# Altium schematic sheet HMI.SchDoc
size A2
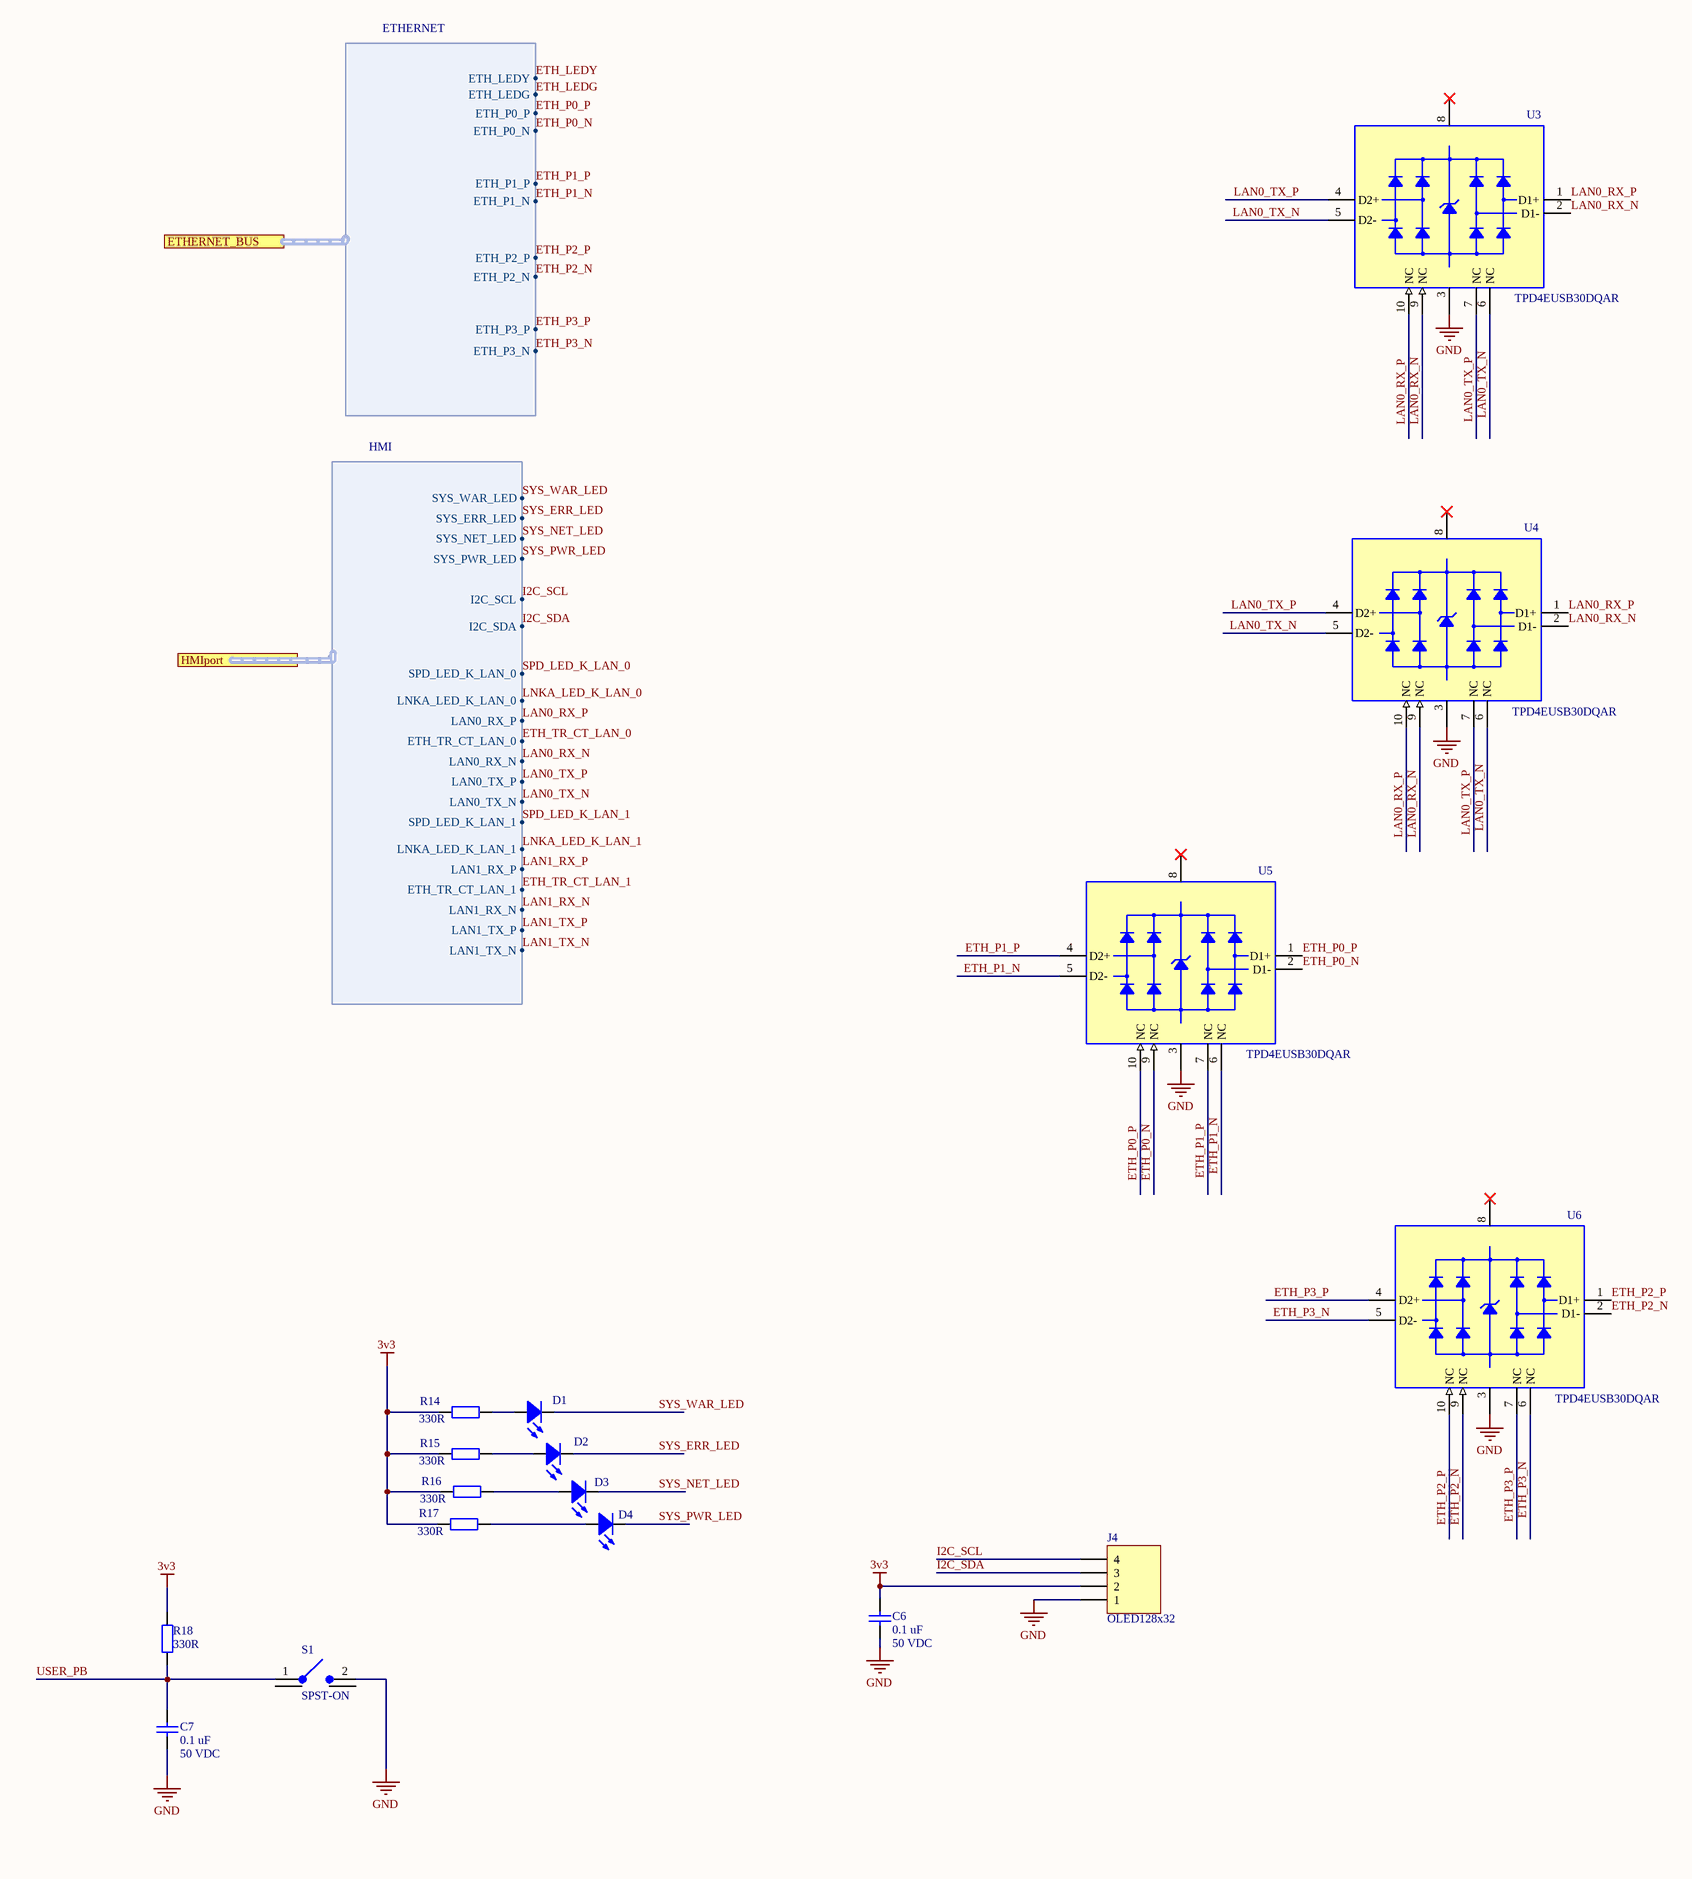
[diagram p0: HMI.SchDoc, left]
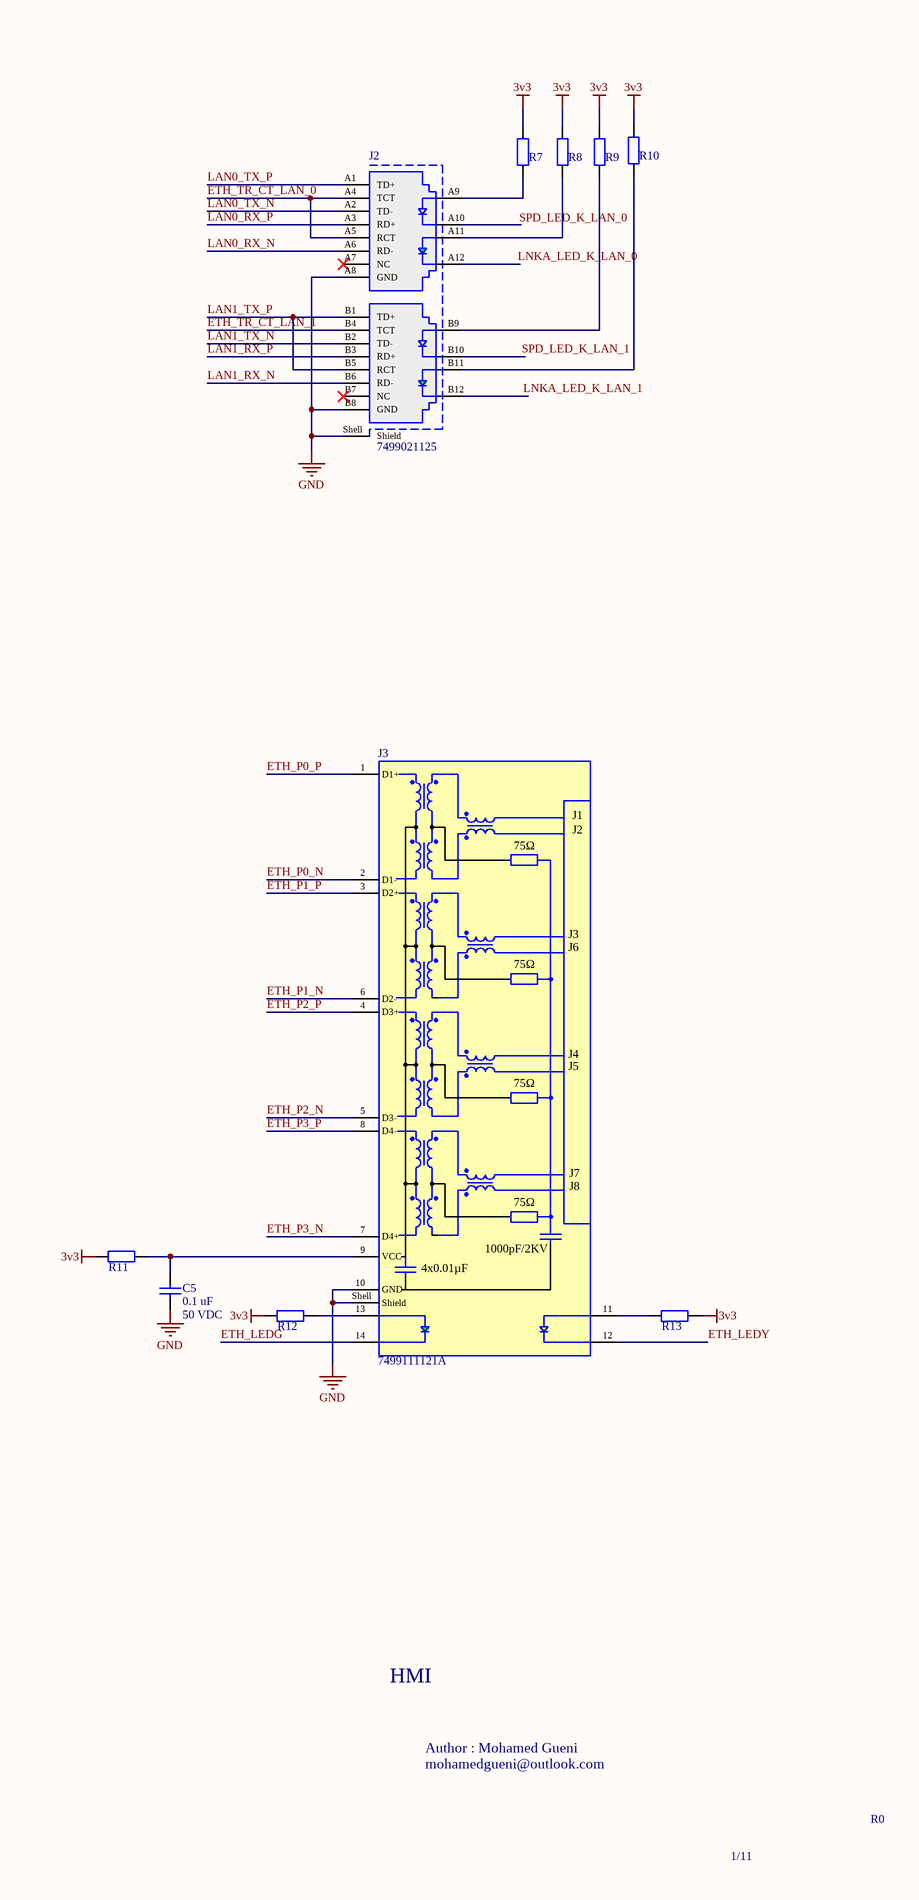
[diagram p1: HMI.SchDoc, right]

## Parts
C5  Value 1: 0.1 uF  Value 2: 50 VDC  [CAPC1608N]  (hidden comment: Capacitor)
C6  Value 1: 0.1 uF  Value 2: 50 VDC  [CAPC1608N]  (hidden comment: Capacitor)
C7  Value 1: 0.1 uF  Value 2: 50 VDC  [CAPC1608N]  (hidden comment: Capacitor)
D1  150060BS75000  [LED0603]  (value not drawn)
D2  150060RS75000  [LED0603]  (value not drawn)
D3  150060GS75000  [LED0603]  (value not drawn)
D4  150060GS75000  [LED0603]  (value not drawn)
J2  7499021125  [WE-RJ45-7499021125]
J3  7499111121A  [WE-RJ45-7499111121A]
J4  OLED128x32  [OLED128x32]
R7  Resistor  [RESC1608N]  (value not drawn)
R8  Resistor  [RESC1608N]  (value not drawn)
R9  Resistor  [RESC1608N]  (value not drawn)
R10  Resistor  [RESC1608N]  (value not drawn)
R11  Resistor  [RESC1608N]  (value not drawn)
R12  Resistor  [RESC1608N]  (value not drawn)
R13  Resistor  [RESC1608N]  (value not drawn)
R14  Value 1: 330R  [RESC1608N]  (hidden comment: Resistor)
R15  Value 1: 330R  [RESC1608N]  (hidden comment: Resistor)
R16  Value 1: 330R  [RESC1608N]  (hidden comment: Resistor)
R17  Value 1: 330R  [RESC1608N]  (hidden comment: Resistor)
R18  Value 1: 330R  [RESC1608N]  (hidden comment: Resistor)
S1  SPST-ON  [118250272]
U3  TPD4EUSB30DQAR  [USON-10]
U4  TPD4EUSB30DQAR  [USON-10]
U5  TPD4EUSB30DQAR  [USON-10]
U6  TPD4EUSB30DQAR  [USON-10]

## Ports
ETHERNET_BUS (harness ETHERNET), HMIport (harness ETHERNET)

## Harnesses
ETHERNET: ETH_LEDY, ETH_P0_P, ETH_P0_N, ETH_P1_P, ETH_P1_N, ETH_P2_P, ETH_P2_N, ETH_P3_P, ETH_P3_N, ETH_LEDG
HMI: SYS_WAR_LED, SYS_NET_LED, SYS_PWR_LED, I2C_SCL, I2C_SDA, SPD_LED_K_LAN_0, SYS_ERR_LED, LNKA_LED_K_LAN_0, LAN0_RX_P, ETH_TR_CT_LAN_0, LAN0_RX_N, LAN0_TX_P, LAN0_TX_N, SPD_LED_K_LAN_1, LNKA_LED_K_LAN_1, LAN1_RX_P, ETH_TR_CT_LAN_1, LAN1_RX_N, LAN1_TX_P, LAN1_TX_N

## Nets
3v3: C6.2 J4.2 R7.2 R8.2 R9.2 R10.2 R11.2 R12.2 R13.2 R14.1 R15.1 R16.1 R17.1 R18.2
GND: C5.1 C6.1 C7.1 J2.A8(GND) J2.B8(GND) J2.Shell(Shield) J3.10(GND) J3.Shell(Shield) J4.1 S1.2(NO) U3.3(GND) U4.3(GND) U5.3(GND) U6.3(GND)
ETH_LEDG: J3.14 ; port ETHERNET_BUS.ETH_LEDG
ETH_LEDY: J3.12 ; port ETHERNET_BUS.ETH_LEDY
ETH_P0_N: J3.2(D1-) U5.2(D1-) U5.9(NC) ; port ETHERNET_BUS.ETH_P0_N
ETH_P0_P: J3.1(D1+) U5.1(D1+) U5.10(NC) ; port ETHERNET_BUS.ETH_P0_P
ETH_P1_N: J3.6(D2-) U5.5(D2-) U5.6(NC) ; port ETHERNET_BUS.ETH_P1_N
ETH_P1_P: J3.3(D2+) U5.4(D2+) U5.7(NC) ; port ETHERNET_BUS.ETH_P1_P
ETH_P2_N: J3.5(D3-) U6.2(D1-) U6.9(NC) ; port ETHERNET_BUS.ETH_P2_N
ETH_P2_P: J3.4(D3+) U6.1(D1+) U6.10(NC) ; port ETHERNET_BUS.ETH_P2_P
ETH_P3_N: J3.7(D4+) U6.5(D2-) U6.6(NC) ; port ETHERNET_BUS.ETH_P3_N
ETH_P3_P: J3.8(D4-) U6.4(D2+) U6.7(NC) ; port ETHERNET_BUS.ETH_P3_P
ETH_TR_CT_LAN_0: J2.A4(TCT) J2.A5(RCT) ; harness HMI.ETH_TR_CT_LAN_0
ETH_TR_CT_LAN_1: J2.B4(TCT) ; harness HMI.ETH_TR_CT_LAN_1
I2C_SCL: J4.4 ; harness HMI.I2C_SCL
I2C_SDA: J4.3 ; harness HMI.I2C_SDA
LAN0_RX_N: J2.A6(RD-) U3.2(D1-) U3.9(NC) U4.2(D1-) U4.9(NC) ; harness HMI.LAN0_RX_N
LAN0_RX_P: J2.A3(RD+) U3.1(D1+) U3.10(NC) U4.1(D1+) U4.10(NC) ; harness HMI.LAN0_RX_P
LAN0_TX_N: J2.A2(TD-) U3.5(D2-) U3.6(NC) U4.5(D2-) U4.6(NC) ; harness HMI.LAN0_TX_N
LAN0_TX_P: J2.A1(TD+) U3.4(D2+) U3.7(NC) U4.4(D2+) U4.7(NC) ; harness HMI.LAN0_TX_P
LAN1_RX_N: J2.B6(RD-) ; harness HMI.LAN1_RX_N
LAN1_RX_P: J2.B3(RD+) ; harness HMI.LAN1_RX_P
LAN1_TX_N: J2.B2(TD-) ; harness HMI.LAN1_TX_N
LAN1_TX_P: J2.B1(TD+) J2.B5(RCT) ; harness HMI.LAN1_TX_P
LNKA_LED_K_LAN_0: J2.A12 ; harness HMI.LNKA_LED_K_LAN_0
LNKA_LED_K_LAN_1: J2.B12 ; harness HMI.LNKA_LED_K_LAN_1
SPD_LED_K_LAN_0: harness HMI.SPD_LED_K_LAN_0
SPD_LED_K_LAN_1: J2.B10 ; harness HMI.SPD_LED_K_LAN_1
SYS_ERR_LED: D2.1(K) ; harness HMI.SYS_ERR_LED
SYS_NET_LED: D3.1(K) ; harness HMI.SYS_NET_LED
SYS_PWR_LED: D4.1(K) ; harness HMI.SYS_PWR_LED
SYS_WAR_LED: D1.1(K) ; harness HMI.SYS_WAR_LED
USER_PB: C7.2 R18.1 S1.1(COM)
NetC5_2: C5.2 J3.9(VCC) R11.1
NetD1_2: D1.2(A) R14.2
NetD2_2: D2.2(A) R15.2
NetD3_2: D3.2(A) R16.2
NetD4_2: D4.2(A) R17.2
NetJ2_A9: J2.A9 R7.1
NetJ2_A11: J2.A11 R8.1
NetJ2_B9: J2.B9 R9.1
NetJ2_B11: J2.B11 R10.1
NetJ3_11: J3.11 R13.1
NetJ3_13: J3.13 R12.1

Not connected (* = marked no-connect by the designer): J2 A7(NC)* A10 B7(NC)*; S1 MH1 MH2; U3 8(GND)*; U4 8(GND)*; U5 8(GND)*; U6 8(GND)*

## Notes on the sheet
- HMI
- Author : Mohamed Gueni
- mohamedgueni@outlook.com
- 1/11
- R0
- Labels drawn without touching a wire or pin: SPD_LED_K_LAN_0
- (in symbol CON-000000002) J1; J2; 75Ω; J6; J4; J5; J7; J8; 1000pF/2KV; 4x0.01µF

## Library data of the parts
C5-C7 = CAP-000000003: MAN: KEMET; MANREF: C0603C104M5RAC; DES: Multilayer Ceramic Capacitors MLCC - SMD/SMT 50V 0.1uF 0603 X7R 20%; TOL: 20 %; FTP: 0603; SUP: Mouser; SUPREF: 80-C0603C104M5RAC; NOTE: _; Part Number: CAP-000000003
D1 = LED-000000003: MAN: Wurth Elektronik; DES: Standard LEDs - SMD WL-SMCW SMDMono TpVw Waterclr 0603 Blue; Value 1: 0.02A; Value 2: 3.2 V; TOL: _; FTP: 0603; SUP: Mouser; SUPREF: 710-150060BS75000; Part Number: LED-000000003; MANREF: 150060BS75000; NOTE: _
D2 = LED-000000001: MAN: Wurth Elektronik; DES: Standard LEDs - SMD WL-SMCW SMDMono TpVw Waterclr 0603 Red; Value 1: 0.02A; Value 2: 2 V; TOL: _; FTP: 0603; SUP: Mouser; SUPREF: 710-150060RS75000; Part Number: LED-000000001; MANREF: 150060RS75000; NOTE: _
D3 D4 = LED-000000002: MAN: Wurth Elektronik; DES: Standard LEDs - SMD WL-SMCW SMDMono TpVw Waterclr 0603 Green; Value 1: 0.02A; Value 2: 3.2 V; TOL: _; FTP: 0603; SUP: Mouser; SUPREF: 710-150060GS75000; Part Number: LED-000000002; MANREF: 150060GS75000; NOTE: _
J2 = CON-000000008: MAN: Wurth Elektronik; DES: Modular Connectors / Ethernet Connectors WE-RJ45 Intgtd XFMR 1x2 THT Tab Down EMI; Value 1: _; Value 2: 10/100BaseT; FTP: THT; SUP: Mouser; SUPREF: 710-7499021125; Part Number: CON-000000008; MANREF: 7499021125; TOL: _; NOTE: _
J3 = CON-000000002: MAN: Wurth Elektronik; DES: Modular Connectors / Ethernet Connectors WE-RJ45 Intgtd XFMR 1x1 THT Tab Down EMI; Value 1: _; Value 2: 10/100/1000BaseT; FTP: THT; SUP: Mouser; SUPREF: 710-7499111121A; Part Number: CON-000000002; MANREF: 7499111121A; TOL: _; NOTE: _
J4 = CON-000000009: Part Number: CON-000000009
R7-R13 = RES-000000008: MAN: KOA Speer; Value 1: 330R; Part Number: RES-000000008
R14-R18 = RES-000000008: MAN: KOA Speer; Part Number: RES-000000008
S1 = S-000000001: MAN: TE Connectivity / P&B; MANREF: 1-1825027-2; DES: Tactile Switches R/A TACT 260 PB SWITCH; Value 1: 50 mA; Value 2: 24 VDC; SUP: Mouser; SUPREF: 506-1-1825027-2; Part Number: S-000000001; NOTE: -
U3-U6 = TVS-000000001: MAN: Texas Instruments; DES: ESD Suppressors / TVS Diodes 4Ch ESD SOLUTION; Value 1: 7 V; Value 2: 0.05 pF; TOL: _; SUP: Mouser; SUPREF: 595-TPD4EUSB30DQAR; Part Number: TVS-000000001; MANREF: TPD4EUSB30DQAR; FTP: USON-10; NOTE: _